# EAGLE design circuitofinal (EAGLE 7.1.0)
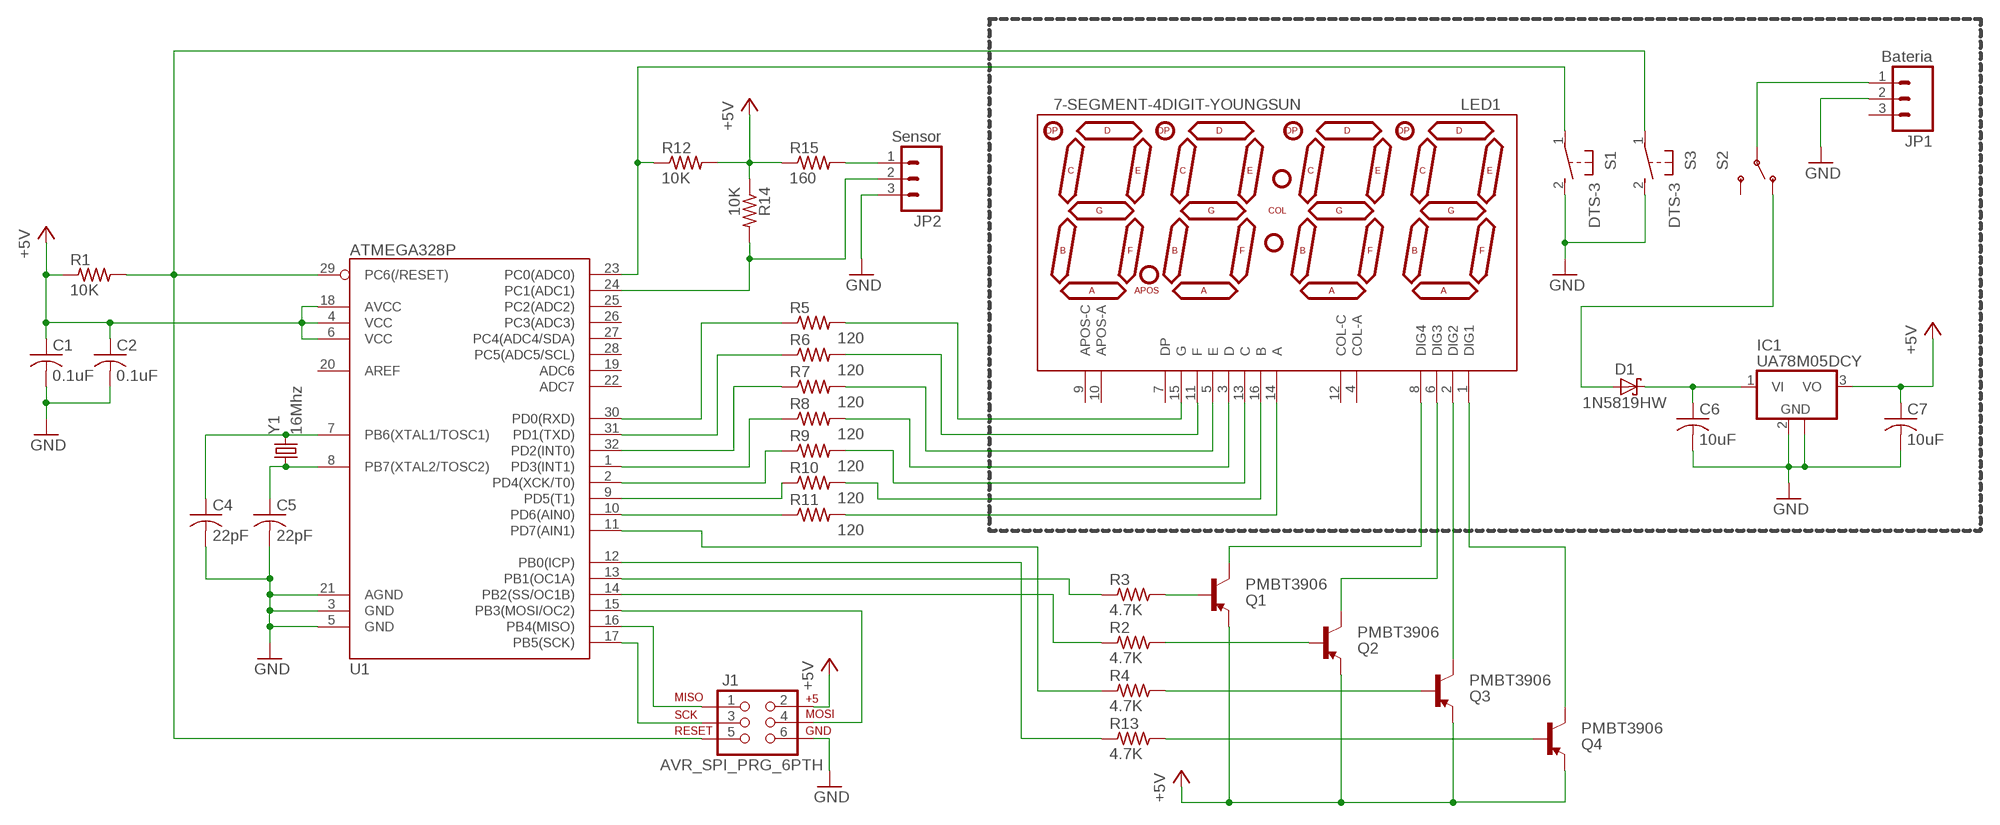
[diagram p0: schematic, sheet 1]

## Parts
C1  0.1uF  C-USC0805  [C0805]
C2  0.1uF  C-USC0805  [C0805]
C4  22pF  C-USC1206  [C1206]
C5  22pF  C-USC1206  [C1206]
C6  10uF  C-USC1206  [C1206]
C7  10uF  C-USC1206  [C1206]
D1  1N5819HW  [SOD-123]
IC1  UA78M05DCY  [SOT223]
J1  AVR_SPI_PRG_6PTH  [2X3]
JP1  Bateria  M03JST-PTH  [JST-3-PTH]
JP2  Sensor  M03JST-PTH  [JST-3-PTH]
LED1  7-SEGMENT-4DIGIT-YOUNGSUN  [7-SEGMENT-4DIGIT-YOUNGSUN]
Q1  PMBT3906  TRANSISTOR_PNPPMBT3906  [SOT23-3]
Q2  PMBT3906  TRANSISTOR_PNPPMBT3906  [SOT23-3]
Q3  PMBT3906  TRANSISTOR_PNPPMBT3906  [SOT23-3]
Q4  PMBT3906  TRANSISTOR_PNPPMBT3906  [SOT23-3]
R1  10K  R-US_R0805  [R0805]
R2  4.7K  R-US_R0805  [R0805]
R3  4.7K  R-US_R0805  [R0805]
R4  4.7K  R-US_R0805  [R0805]
R5  120  R-US_R0805  [R0805]
R6  120  R-US_R0805  [R0805]
R7  120  R-US_R0805  [R0805]
R8  120  R-US_R0805  [R0805]
R9  120  R-US_R0805  [R0805]
R10  120  R-US_R0805  [R0805]
R11  120  R-US_R0805  [R0805]
R12  10K  R-US_R0805  [R0805]
R13  4.7K  R-US_R0805  [R0805]
R14  10K  R-US_R0805  [R0805]
R15  160  R-US_R1206  [R1206]
S1  DTS-3  [DTS-3]
S2  SWITCH-SPDTPTH  [SWITCH-SPDT]
S3  DTS-3  [DTS-3]
U1  ATMEGA328P  ATMEGA328_SMT  [TQFP32-08]
Y1  16Mhz  CRYSTALHC49US  [HC49US]

## Nets
+5V: C1.1 C2.1 C7.1 IC1.3(VO) J1.2 Q1.2(E) Q2.2(E) Q3.2(E) Q4.2(E) R1.1 R12.2 R14.1 R15.1 U1.4(VCC) U1.6(VCC) U1.18(AVCC)
GND: C1.2 C2.2 C4.2 C5.2 C6.2 C7.2 IC1.2(GND) IC1.4(GND) J1.6 JP1.2 JP2.3 S1.2 S3.2 U1.3(GND) U1.5(GND) U1.21(AGND)
N$1: Q2.1(B) R2.2
N$2: Q3.1(B) R4.2
N$3: Q4.1(B) R13.2
N$4: LED1.8(DIG4) Q1.3(C)
N$5: LED1.3(D) R8.2
N$6: LED1.6(DIG3) Q2.3(C)
N$7: LED1.16(B) R10.2
N$8: LED1.14(A) R11.2
N$9: JP1.1 S2.2(P)
N$10: C6.1 D1.C IC1.1(VI)
N$11: LED1.11(F) R6.2
N$12: R12.1 S1.1 U1.23(PC0(ADC0))
N$13: Q1.1(B) R3.2
N$14: C4.1 U1.7(PB6(XTAL1/TOSC1)) Y1.2
N$15: C5.1 U1.8(PB7(XTAL2/TOSC2)) Y1.1
N$16: JP2.2 R14.2 U1.24(PC1(ADC1))
N$17: J1.3 U1.17(PB5(SCK))
N$18: J1.1 U1.16(PB4(MISO))
N$19: J1.4 U1.15(PB3(MOSI/OC2))
N$20: LED1.1(DIG1) Q4.3(C)
N$21: LED1.2(DIG2) Q3.3(C)
N$22: R3.1 U1.13(PB1(OC1A))
N$23: R2.1 U1.14(PB2(SS/OC1B))
N$24: R4.1 U1.11(PD7(AIN1))
N$25: R5.1 U1.30(PD0(RXD))
N$26: R6.1 U1.31(PD1(TXD))
N$27: R7.1 U1.32(PD2(INT0))
N$30: R10.1 U1.9(PD5(T1))
N$31: R11.1 U1.10(PD6(AIN0))
N$32: LED1.15(G) R5.2
N$33: R13.1 U1.12(PB0(ICP))
N$34: D1.A S2.1(O)
N$36: LED1.5(E) R7.2
N$37: JP2.1 R15.2
N$39: J1.5 R1.2 S3.1 U1.29(PC6(/RESET))
N$40: LED1.13(C) R9.2
PIN1: R8.1 U1.1(PD3(INT1))
PIN2: R9.1 U1.2(PD4(XCK/T0))
Unconnected: JP1.3 LED1.4(COL-A) LED1.7(DP) LED1.9(APOS-C) LED1.10(APOS-A) LED1.12(COL-C) S2.3(S) U1.19(ADC6) U1.20(AREF) U1.22(ADC7) U1.25(PC2(ADC2)) U1.26(PC3(ADC3)) U1.27(PC4(ADC4/SDA)) U1.28(PC5(ADC5/SCL))

## Library data of the parts
C1 C2 C4-C7 = rcl:C-US: CAPACITOR, American symbol
D1 = iv17:1N5819HW: 1N5819HW 1.0A SURFACE MOUNT SCHOTTKY BARRIER RECTIFIER
IC1 = linear:UA78M*: POSITIVE-VOLTAGE REGULATORS Source: http://focus.ti.com/lit/ds/symlink/ua78m33.pdf
J1 = SparkFun-Connectors:AVR_SPI_PRG_6: AVR ISP 6 Pin This is the reduced ISP connector for AVR programming. Common on Arduino. This footprint will take up less PCB space and can be used with a 10-pin to 6-pin adapter such as SKU: BOB-08508 **Special note about "TEST_POINT" package. The stop mask is on the top side, so if you want your programming test points to be on the bottom of your board, make sure to place this package on the bottom side of the board. This also ensure that the orientation to program from the bottom side will be correct.
JP1 JP2 = SparkFun-Connectors:M03: Header 3 Standard 3-pin 0.1" header. Use with straight break away headers (SKU : PRT-00116), right angle break away headers (PRT-00553), swiss pins (PRT-00743), machine pins (PRT-00117), and female headers (PRT-00115). Molex polarized connector foot print use with SKU : PRT-08232 with associated crimp pins and housings.; SKU: PRT-09915
LED1 = SparkFun-Displays:7-SEGMENT-4DIGIT-YOUNGSUN: This is a part for the 4-Digit 7-segment LEDs from Young Sun. Different from the Digikey LEDs, all 16 pins are used. The LONGPADS Variant is used for a test jig, but you may like it because there is more pad to solder to. If you are concerned about routing space, the standard works just fine though.
Q1-Q4 = SparkFun-DiscreteSemi:TRANSISTOR_PNP: Generic PNP BJT Double check pinouts against datasheets- not all devices are the same! MMBT3906 - 40V 200mA SOT-23 (TRANS-08052) MMBT4403 - 40V 600mA SOT-23 (TRANS-09245); PROD_ID: TRANS-08052
R1-R15 = rcl:R-US_: RESISTOR, American symbol
S1 S3 = switch-tact:DTS-3
S2 = SparkFun-Electromechanical:SWITCH-SPDT: SPDT Switch Simple slide switch, Spark Fun Electronics SKU : COM-00102 DPDT SMT slide switch, AYZ0202, SWCH-08179; PROD_ID: SWCH-08261
U1 = SparkFun-DigitalIC:ATMEGA328_SMT: 32-Pin Atmega328 part Commonly used on Arduino compatible boards Available in QFP and QFN packages TQFP is IC-09069 QFN is non-stock; PROD_ID: IC-09069
Y1 = SparkFun-FreqCtrl:CRYSTAL: Various standard crystals. Proven footprints. Spark Fun Electronics SKU : COM-00534

## Board
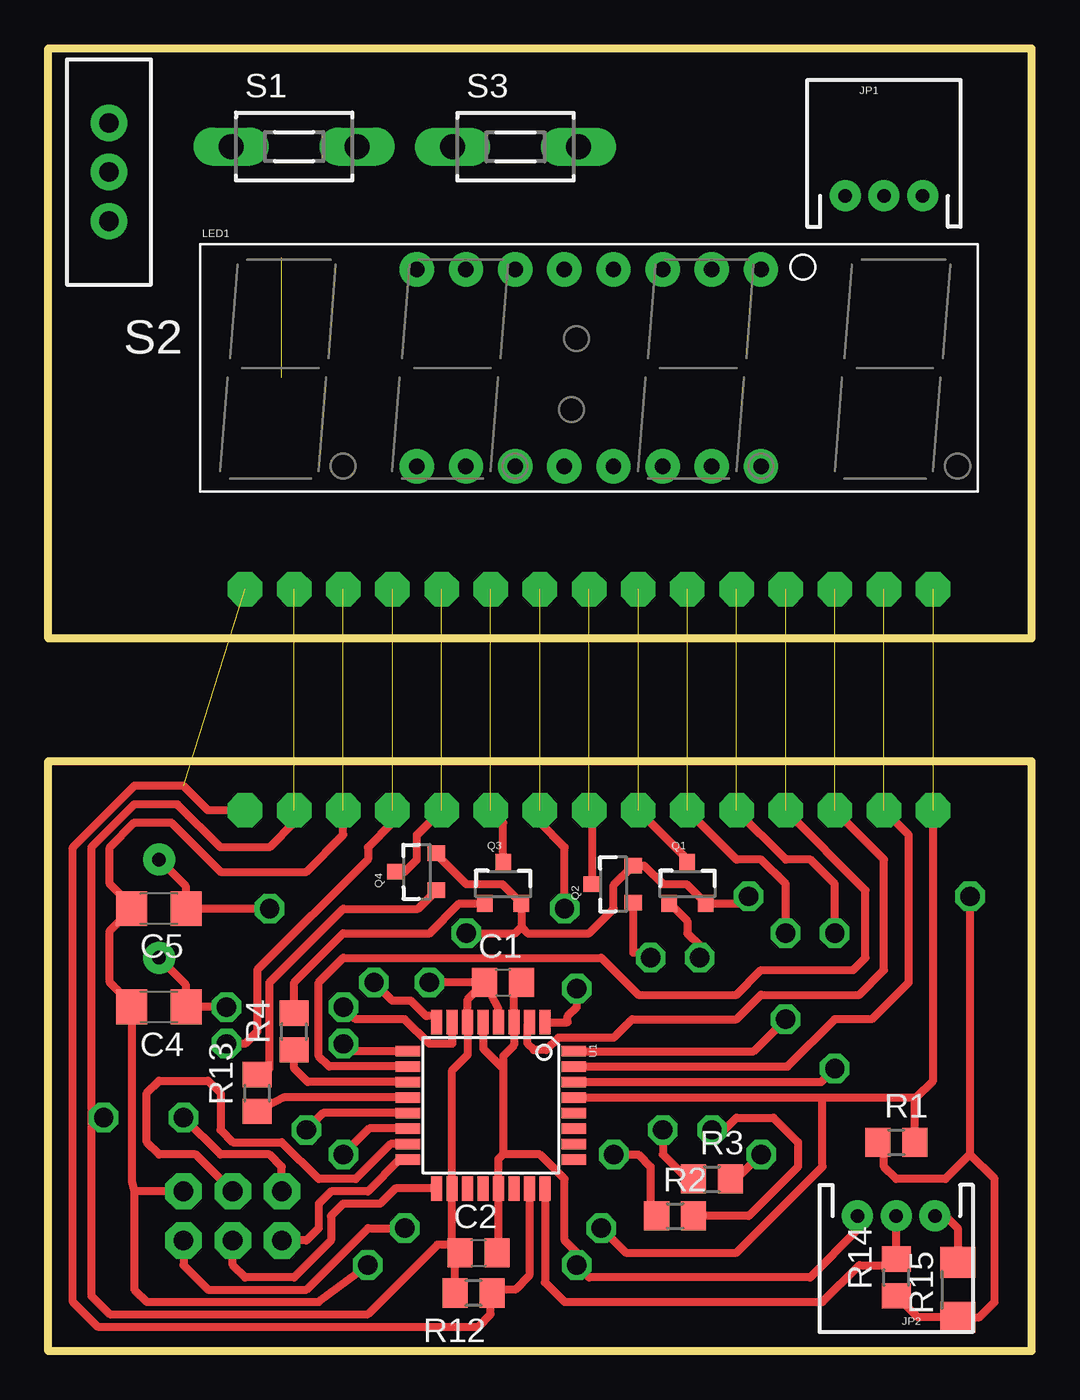
[diagram p1: board, top side]
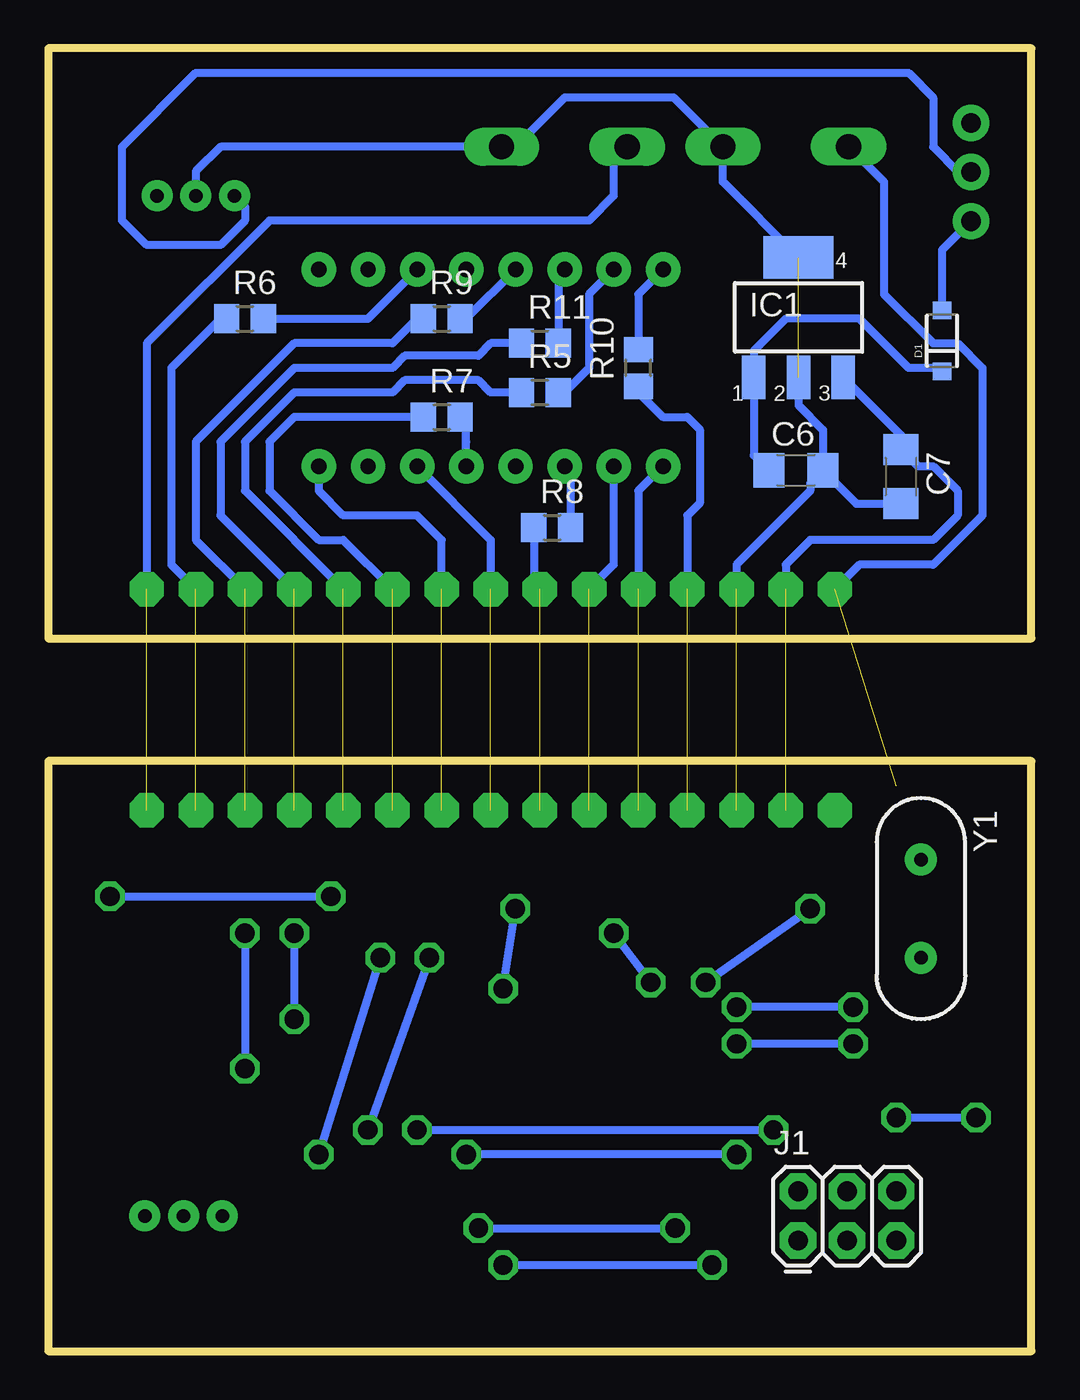
[diagram p2: board, bottom side, seen from below]

Size 50.8 x 67.31 mm. Coordinates in mm from the lower left corner, seen from the top.
Outline: 0,36.83 0,67.31 50.8,67.31 50.8,36.83 0,36.83
Outline: 0,30.48 50.8,30.48 50.8,0 0,0 0,30.48
Copper layers (1*16): Top 0.035mm / dielectric 1.5mm / Bottom 0.035mm
Design rules "default": minimum track width 10mil, minimum drill 24mil, track to track 8mil, track to pad 8mil, pad to pad 8mil, via to via 8mil, smd to smd 8mil, copper to edge 40mil, drill to drill 8mil, minimum pad ring 10mil, minimum via ring 8mil, stop-mask expansion 4mil, vias tented up to drill 0mil, thermal gap 10mil

### Footprints (pad centres in the part's own frame; a part is rotated, then mirrored left to right if it is on the bottom)
C0805 = smd 1.3 x 1.5: 1 -0.95,0; 2 0.95,0
C1206 = smd 1.6 x 1.8: 1 -1.4,0; 2 1.4,0
SOD-123 = smd 0.9 x 0.95: A 1.575,0; C -1.575,0
SOT223 = smd 1.219 x 2.235: 1 -2.311,-3.099; 2 0,-3.099; 3 2.311,-3.099 | smd 3.6 x 2.2: 4 0,3.099
2X3 = drill 1.016 pad 1.88 octagon: 1 0,0; 2 0,2.54; 3 2.54,0; 4 2.54,2.54; 5 5.08,0; 6 5.08,2.54
JST-3-PTH = drill 0.7 pad 1.6: 1 -2,0; 2 0,0; 3 2,0
7-SEGMENT-4DIGIT-YOUNGSUN = drill 0.8 pad 1.778: 1 -8.89,-5.08; 2 -6.35,-5.08; 3 -3.81,-5.08; 4 -1.27,-5.08; 5 1.27,-5.08; 6 3.81,-5.08; 7 6.35,-5.08; 8 8.89,-5.08; 9 8.89,5.08; 10 6.35,5.08; 11 3.81,5.08; 12 1.27,5.08; 13 -1.27,5.08; 14 -3.81,5.08; 15 -6.35,5.08; 16 -8.89,5.08
SOT23-3 = smd 0.8 x 0.9: 1 -0.95,-1; 2 0.95,-1; 3 0,1.1
R0805 = smd 1.3 x 1.5: 1 -0.95,0; 2 0.95,0
R1206 = smd 1.6 x 1.803: 1 -1.422,0; 2 1.422,0
DTS-3 = drill 1.3 long: 1 -3.25,0; 2 3.25,0
SWITCH-SPDT = drill 1.016 pad 1.88: 1 0,2.54; 2 0,0; 3 0,-2.54
TQFP32-08 = smd 1.27 x 0.559: 1 -4.293,2.8; 2 -4.293,2; 3 -4.293,1.2; 4 -4.293,0.4; 5 -4.293,-0.4; 6 -4.293,-1.2; 7 -4.293,-2; 8 -4.293,-2.8; 17 4.293,-2.8; 18 4.293,-2; 19 4.293,-1.2; 20 4.293,-0.4; 21 4.293,0.4; 22 4.293,1.2; 23 4.293,2; 24 4.293,2.8 | smd 0.559 x 1.27: 9 -2.8,-4.293; 10 -2,-4.293; 11 -1.2,-4.293; 12 -0.4,-4.293; 13 0.4,-4.293; 14 1.2,-4.293; 15 2,-4.293; 16 2.8,-4.293; 25 2.8,4.293; 26 2,4.293; 27 1.2,4.293; 28 0.4,4.293; 29 -0.4,4.293; 30 -1.2,4.293; 31 -2,4.293; 32 -2.8,4.293
HC49US = drill 0.7 pad 1.651: 1 -2.54,0; 2 2.54,0

### Placement (x,y rotation side)
C1  23.49,19.05 0 top
C2  22.22,5.08 0 top
C4  5.72,17.78 180 top
C5  5.72,22.86 180 top
C6  12.17,45.51 0 bottom
C7  6.75,45.19 270 bottom
D1  4.62,52.2 90 bottom
IC1  12.04,53.41 0 bottom
J1  12.06,5.71 0 bottom
JP1  43.18,59.69 0 top
JP2  43.82,6.98 180 top
LED1  27.93,50.8 0 top
Q1  33.02,24.13 0 top
Q2  29.21,24.13 90 top
Q3  23.49,24.13 0 top
Q4  19.05,24.77 90 top
R1  43.82,10.8 0 top
R2  32.39,6.98 0 top
R3  34.29,8.89 0 top
R4  12.7,16.51 90 top
R5  25.4,49.53 0 bottom
R6  40.64,53.34 0 bottom
R7  30.48,48.26 0 bottom
R8  24.76,42.55 0 bottom
R9  30.48,53.34 0 bottom
R10  20.32,50.8 90 bottom
R11  25.4,52.07 0 bottom
R12  21.97,3 180 top
R13  10.79,13.34 90 top
R14  43.82,3.81 90 top
R15  46.99,3.18 90 top
S1  12.7,62.24 0 top
S2  3.13,60.92 180 top
S3  24.14,62.23 0 top
U1  22.86,12.7 270 top
Y1  5.72,22.86 270 bottom

### Tracks (layer width: path | path; a pad name or v marks a point on that pad's centre or on a via)
+5V  (via drill 0 pad 1.78, 1 pad 1.52)  (1 unrouted)
  Top 0.406: 24.44,21.91 Q3.2 23.45,24.13 21.59,24.13 20,25.71 Q4.2 | 24.44,21.91 24.76,21.59 27.94,21.59 29.21,22.86 29.21,24.08 Q2.2 30.8,25.08 31.75,24.13 32.97,24.13 Q1.2 35.83,23.13 v36.2,23.5 | C1.1 21.66,18.16 U1.6 21.66,15.31 20.86,14.51 U1.18 20.86,5.5 | C1.1 v19.68,19.05 | v21.59,21.59 24.12,21.59 24.44,21.91 | v12.7,27.94 12.7,27.3 11.43,26.04 8.89,26.04 6.67,28.26 4.44,28.26 2.22,26.04 2.22,12.07 | 20.86,5.5 C2.1 21.02,4.82 R12.2 | J1.2 12.06,9.53 11.43,10.16 8.89,10.16 v6.99,12.07 | v2.86,12.07 2.22,12.07 | 2.22,12.07 2.22,2.86 3.17,1.91 16.51,1.91 20.1,5.5 20.86,5.5 | R14.1 44.92,1.75 R15.1 48.11,1.75 48.9,2.54 48.9,8.89 47.62,10.16 | v47.62,23.5 47.62,10.16 | 47.62,10.16 46.36,8.89 43.82,8.89 43.18,9.53 43.18,10.48 R1.1 | U1.4 23.26,17.7 C1.1
  Bottom 0.406: IC1.3 6.75,47.33 C7.1 5.88,45.72 5.08,45.72 3.81,44.45 3.81,43.18 5.08,41.91 11.43,41.91 12.7,40.64 v12.7,39.37 | v19.68,19.05 v21.59,21.59 | v2.86,12.07 v6.99,12.07 | v47.62,23.5 v36.2,23.5
GND  (via drill 0 pad 1.78, 1 pad 1.52)  (2 unrouted)
  Top 0.406: C1.2 24.06,18.8 U1.3 24.06,15.8 23.49,15.24 23.49,14.61 | 23.49,10.16 23.26,9.93 U1.21 23.26,5.63 C2.2 | U1.5 22.46,15.64 23.49,14.61 | 23.49,14.61 23.49,10.16 | v15.24,27.94 15.24,26.67 13.33,24.77 8.89,24.77 6.35,27.3 4.44,27.3 3.17,26.04 3.17,24.13 4.32,22.99 C5.2 3.17,21.72 3.17,19.05 4.32,17.91 C4.2 4.32,8.76 4.44,8.25 | 4.44,8.25 4.44,3.18 5.08,2.54 13.97,2.54 v16.51,4.45 | 23.49,10.16 25.4,10.16 26.67,8.89 26.67,5.71 27.3,5.08 v27.3,4.45 27.94,3.81 39.37,3.81 41.82,6.25 JP2.3 | J1.6 4.44,8.25
  Bottom 0.406: JP1.2 43.18,60.96 41.91,62.23 S3.2 26.67,62.23 24.13,64.77 18.48,64.77 S1.2 15.95,60.42 IC1.4 | IC1.2 12.04,48.87 10.77,47.6 C6.2 | C6.2 9.05,43.79 C7.2 | C6.2 11.43,44.85 11.43,44.45 15.24,40.64 v15.24,39.37 | v16.51,4.45 v27.3,4.45
N$1  (via drill 1 pad 1.52)
  Top 0.406: Q2.1 30.21,20.59 30.85,20.59 v31.11,20.32 | v34.29,11.43 34.93,11.43 35.56,12.07 37.47,12.07 38.73,10.8 38.73,9.53 36.2,6.98 R2.2
  Bottom 0.406: v31.11,20.32 v34.29,11.43
N$2
  Top 0.406: R4.2 12.7,19.05 15.24,21.59 19.68,21.59 | 19.73,21.59 19.68,21.59 | 19.68,21.59 21.22,23.13 Q3.1
N$3
  Top 0.406: R13.2 11.11,14.29 11.43,14.61 11.43,19.05 15.24,22.86 19.09,22.86 Q4.1
N$4  (via drill 0 pad 1.78)  (1 unrouted)
  Top 0.406: Q1.3 33.02,25.4 v30.48,27.94
  Bottom 0.406: v30.48,39.37 30.48,41.91 31.75,43.18 35.56,43.18 36.82,44.44 LED1.8
N$5
  Bottom 0.406: LED1.3 23.81,45.41 R8.2
N$6  (via drill 0 pad 1.78)  (1 unrouted)
  Top 0.406: Q2.3 28.11,27.77 v27.94,27.94
  Bottom 0.406: LED1.6 27.94,41.91 v27.94,39.37
N$7
  Bottom 0.406: LED1.16 20.32,54.61 R10.2
N$8
  Bottom 0.406: LED1.14 24.45,55.55 R11.2
N$9
  Bottom 0.406: JP1.1 40.64,59.15 40.64,58.42 41.91,57.15 45.72,57.15 46.99,58.42 46.99,62.23 43.18,66.04 6.35,66.04 5.08,64.77 5.08,62.23 3.77,60.92 S2.2
N$10
  Bottom 0.406: D1.C 4.79,50.8 6.35,50.8 8.89,53.34 12.7,53.34 14.35,51.69 IC1.1 14.35,46.29 C6.1
N$11
  Bottom 0.406: R6.2 34.28,53.34 LED1.11
N$12  (via drill 0 pad 1.78)  (1 unrouted)
  Top 0.406: v10.16,27.94 8.25,27.94 6.99,29.21 4.44,29.21 1.27,26.04 1.27,2.54 2.54,1.27 22.22,1.27 22.86,1.91 22.86,2.94 R12.1 23.09,3.18 24.13,3.18 24.86,3.91 U1.23
  Bottom 0.406: S1.1 7.62,60.41 7.62,54.61 5.08,52.07 3.81,52.07 2.54,50.8 2.54,43.18 5.08,40.64 8.89,40.64 v10.16,39.37
N$13  (via drill 1 pad 1.52)
  Top 0.406: v36.83,10.16 35.56,8.89 R3.2 | Q1.1 32.12,23.13 33.02,22.23 33.02,21.59 33.66,20.95 v33.66,20.32
  Bottom 0.406: v33.66,20.32 v36.83,10.16
N$14  (via drill 1 pad 1.52)
  Top 0.406: Y1.2 7.11,18.92 C4.1 v9.21,17.78 | U1.7 20.86,15.88 19.68,15.88 18.41,17.14 15.88,17.14 15.56,17.46 v15.24,17.78
  Bottom 0.406: v9.21,17.78 v15.24,17.78
N$15  (via drill 1 pad 1.52)
  Top 0.406: Y1.1 7.11,24 C5.1 v11.43,22.86 | U1.8 20.15,17.31 19.52,17.31 18.73,18.1 17.78,18.1 v16.83,19.05
  Bottom 0.406: v11.43,22.86 v16.83,19.05
N$16
  Top 0.406: JP2.2 R14.2 43.5,4.45 41.91,4.45 40.01,2.54 26.67,2.54 25.66,3.55 U1.24
N$17
  Top 0.406: U1.17 17.93,8.41 17.14,7.62 15.24,7.62 14.61,6.98 14.61,5.71 12.7,3.81 10.16,3.81 9.52,4.45 J1.3
N$18
  Top 0.406: U1.16 18.15,9.9 16.51,8.25 14.61,8.25 13.97,7.62 13.97,6.35 13.33,5.71 J1.1
N$19
  Top 0.406: J1.4 7.62,10.16 5.72,10.16 5.08,10.8 5.08,13.34 5.72,13.97 8.25,13.97 8.89,13.34 8.89,11.43 9.52,10.8 12.06,10.8 13.97,8.89 15.88,8.89 17.68,10.7 U1.15
N$20  (via drill 0 pad 1.78)  (1 unrouted)
  Top 0.406: Q4.3 18.41,24.77 19.05,25.4 19.05,26.67 v20.32,27.94
  Bottom 0.406: LED1.1 20.32,44.45 v20.32,39.37
N$21  (via drill 0 pad 1.78)  (1 unrouted)
  Top 0.406: Q3.3 23.49,27.3 v22.86,27.94
  Bottom 0.406: LED1.2 21.59,40.64 v22.86,39.37
N$22  (via drill 1 pad 1.52)
  Top 0.406: U1.13 14.2,12.3 v13.33,11.43 | v31.75,11.43 31.75,10.16 33.02,8.89 R3.1
  Bottom 0.406: v31.75,11.43 v13.33,11.43
N$23  (via drill 1 pad 1.52)
  Top 0.406: U1.14 16.58,11.5 v15.24,10.16 | v29.21,10.16 30.48,10.16 31.11,9.53 31.11,7.3 R2.1
  Bottom 0.406: v15.24,10.16 v29.21,10.16
N$24
  Top 0.406: U1.11 13.4,13.9 12.7,14.61 R4.1
N$25  (via drill 0 pad 1.78, 1 pad 1.52)  (1 unrouted)
  Top 0.406: U1.30 39.94,13.9 v40.64,14.61 | v40.64,21.59 40.64,24.13 39.37,25.4 38.1,25.4 v35.56,27.94
  Bottom 0.406: R5.1 27.94,49.53 28.57,50.16 32.39,50.16 33.02,49.53 38.1,49.53 40.64,46.99 40.64,44.45 v35.56,39.37 | v40.64,21.59 v40.64,14.61
N$26  (via drill 0 pad 1.78)  (1 unrouted)
  Top 0.406: U1.31 38.2,14.7 40.64,17.14 42.55,17.14 44.45,19.05 44.45,26.67 v43.18,27.94
  Bottom 0.406: R6.1 41.91,53.34 44.45,50.8 44.45,40.64 v43.18,39.37
N$27  (via drill 0 pad 1.78, 1 pad 1.52)  (1 unrouted)
  Top 0.406: U1.32 36.46,15.5 v38.1,17.14 | v38.1,21.59 38.1,24.13 36.83,25.4 35.56,25.4 v33.02,27.94
  Bottom 0.406: R7.1 38.1,48.26 39.37,46.99 39.37,44.45 36.83,41.91 35.56,41.91 v33.02,39.37 | v38.1,21.59 v38.1,17.14
N$30  (via drill 0 pad 1.78, 1 pad 1.52)  (1 unrouted)
  Top 0.406: U1.9 15.61,15.5 v15.24,15.88 | v9.21,15.88 10.16,15.88 10.79,16.51 10.79,19.69 16.51,25.4 16.51,26.04 17.78,27.3 v17.78,27.94
  Bottom 0.406: R10.1 20.32,49.53 19.05,48.26 17.78,48.26 17.14,47.62 17.14,43.81 17.78,43.18 v17.78,39.37 | v9.21,15.88 v15.24,15.88
N$31  (via drill 0 pad 1.78)  (1 unrouted)
  Top 0.406: U1.10 14.51,14.7 13.97,15.24 13.97,19.05 15.24,20.32 28.57,20.32 30.48,18.41 35.56,18.41 36.83,19.69 41.59,19.69 42.23,20.32 42.23,23.81 v38.1,27.94
  Bottom 0.406: R11.1 27.94,52.07 28.57,51.44 32.39,51.44 33.02,50.8 38.1,50.8 41.91,46.99 41.91,43.18 v38.1,39.37
N$32
  Bottom 0.406: LED1.15 22.86,54.61 22.86,50.8 24.13,49.53 R5.2
N$33
  Top 0.406: U1.12 12.14,13.1 R13.1
N$34
  Bottom 0.406: S2.1 4.62,56.89 D1.A
N$36
  Bottom 0.406: LED1.5 29.21,46.99 29.21,48.26 R7.2
N$37
  Top 0.406: JP2.1 46.36,6.98 46.99,6.35 R15.2
N$39  (via drill 0 pad 1.78, 1 pad 1.52)  (1 unrouted)
  Top 0.406: 44.85,13.1 45.72,13.97 v45.72,27.94 | U1.29 40.01,13.1 | 40.01,13.1 44.85,13.1 | J1.5 6.99,4.45 8.25,3.18 13.33,3.18 16.51,6.35 v18.41,6.35 | v28.57,6.35 29.85,5.08 35.56,5.08 40.01,9.53 40.01,13.1 | R1.2 44.77,13.02 44.85,13.1
  Bottom 0.406: S3.1 21.59,61.52 21.59,59.69 22.86,58.42 39.37,58.42 45.72,52.07 v45.72,39.37 | v28.57,6.35 v18.41,6.35
N$40
  Bottom 0.406: LED1.13 29.21,53.34 29.21,53.66 R9.2
PIN1  (via drill 0 pad 1.78, 1 pad 1.52)  (1 unrouted)
  Top 0.406: U1.1 26.83,16.99 26.83,17.31 27.3,17.78 v27.3,18.73 | v26.67,22.86 26.67,26.04 25.4,27.3 v25.4,27.94
  Bottom 0.406: R8.1 25.71,39.69 v25.4,39.37 | v27.3,18.73 v26.67,22.86
PIN2  (via drill 0 pad 1.78)  (1 unrouted)
  Top 0.406: v40.64,27.94 43.18,25.4 43.18,19.69 41.91,18.41 36.83,18.41 35.56,17.14 30.16,17.14 29.21,16.19 26.35,16.19 25.72,15.56 25.08,15.56 24.76,15.88 24.76,16.9 U1.2
  Bottom 0.406: R9.1 31.75,53.34 33.02,52.07 38.1,52.07 43.18,46.99 43.18,41.91 v40.64,39.37